# Altium schematic sheet Sensor_Module.SchDoc: Sensor Module
size A4; DocumentNumber: 7; SheetNumber: 7; SheetTotal: 31
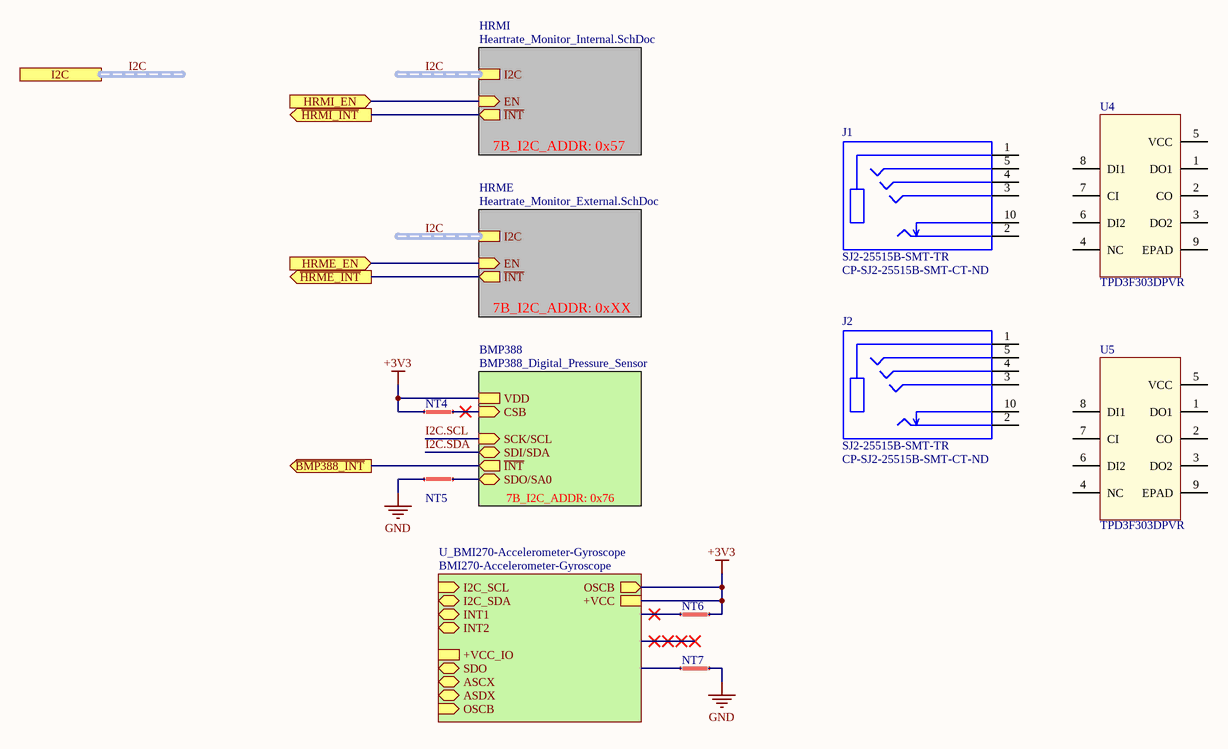
[diagram p0: Sensor_Module.SchDoc]

## Parts
J1  SJ2-25515B-SMT-TR  Supplier Part Number 1: CP-SJ2-25515B-SMT-CT-ND  [CUI_SJ2-25515B-SMT-TR]
J2  SJ2-25515B-SMT-TR  Supplier Part Number 1: CP-SJ2-25515B-SMT-CT-ND  [CUI_SJ2-25515B-SMT-TR]
NT4  Net Tie  [Net Tie 6x30mil]  (value not drawn)  (net tie, no BOM)
NT5  Net Tie  [Net Tie 6x30mil]  (value not drawn)  (net tie, no BOM)
NT6  Net Tie  [Net Tie 6x30mil]  (value not drawn)  (net tie, no BOM)
NT7  Net Tie  [Net Tie 6x30mil]  (value not drawn)  (net tie, no BOM)
U4  TPD3F303DPVR  [DPV8_1P7X0P4]
U5  TPD3F303DPVR  [DPV8_1P7X0P4]

## Sub-sheets
BMP388 = BMP388_Digital_Pressure_Sensor: VDD, SCK/SCL (in), SDI/SDA (bidir), SDO/SA0 (bidir), CSB (in), ~{INT} (out)  | 7B_I2C_ADDR: 0x76
HRME = Heartrate_Monitor_External.SchDoc: I2C (harness I2C), EN (in), ~{INT} (out)  | 7B_I2C_ADDR: 0xXX
HRMI = Heartrate_Monitor_Internal.SchDoc: I2C (harness I2C), EN (in), ~{INT} (out)  | 7B_I2C_ADDR: 0x57
U_BMI270-Accelerometer-Gyroscope = BMI270-Accelerometer-Gyroscope: I2C_SCL (in), I2C_SDA (bidir), INT1 (bidir), INT2 (bidir), +VCC, +VCC_IO, SDO (bidir), ASCX (bidir), ASDX (bidir), OSCB (in), OSCB (out)

## Ports
HRME_EN (in), HRMI_EN (in), I2C (harness I2C), ~{BMP388_INT} (out), ~{HRME_INT} (out), ~{HRMI_INT} (out)

## Nets
+3V3: NT4.1 NT6.2 ; sheet BMP388/VDD, sheet U_BMI270-Accelerometer-Gyroscope/+VCC, sheet U_BMI270-Accelerometer-Gyroscope/OSCB
GND: NT5.2 NT7.2
~{BMP388_INT}: port ~{BMP388_INT}, sheet BMP388/~{INT}
~{HRME_INT}: port ~{HRME_INT}, sheet HRME/~{INT}
~{HRMI_INT}: port ~{HRMI_INT}, sheet HRMI/~{INT}
HRME_EN: port HRME_EN, sheet HRME/EN
HRMI_EN: port HRMI_EN, sheet HRMI/EN
I2C.SCL: sheet BMP388/SCK/SCL
I2C.SDA: sheet BMP388/SDI/SDA
NetNT4_2: NT4.2 ; sheet BMP388/CSB
NetNT5_1: NT5.1 ; sheet BMP388/SDO/SA0

Not connected (* = marked no-connect by the designer): J1 1(OUTER_RING) 2(TIP) 3(RING1) 4(RING2) 5(SLEEVE) 10(TIP_SWITCH); J2 1(OUTER_RING) 2(TIP) 3(RING1) 4(RING2) 5(SLEEVE) 10(TIP_SWITCH); NT6 1*; NT7 1; U4 1(DO1) 2(CO) 3(DO2) 4(NC) 5(VCC) 6(DI2) 7(CI) 8(DI1) 9(EPAD); U5 1(DO1) 2(CO) 3(DO2) 4(NC) 5(VCC) 6(DI2) 7(CI) 8(DI1) 9(EPAD)

## Buses and harness runs
harness I2C = port I2C
harness I2C = sheet HRME/I2C
harness I2C = sheet HRMI/I2C

## Notes on the sheet
- Title
- Size:
- Date:
- A4
- Number:
- Time:
- Revision:
- Sheet
- of
- File:

## Library data of the parts
J1 J2 = SJ2-25515B-SMT-TR: 5 conductor, 2.5 mm, SMT Audio Jack w/ Tip Switch; MF: CUI; Contact: 5(Excludes TIP Switch); Specification: 5-Contact 2.5mm; Package: None; Price: None; Value: *; MP: SJ2-25515B-SMT-TR; Availability: Unavailable; Supplier 1: Digi-Key; Datasheet: https://www.cuidevices.com/product/resource/sj2-2551x-smt.pdf
NT4-NT7 = Net Tie Line: ClassName: Net Tie
U4 U5 = FILTER RC(PI) ESD SMD  8-UFDFN EP: RC (Pi) EMI Filter 2nd Order Low Pass 3 Channel R = 47Ohms, 100Ohms, C = 20pF  8-UFDFN Exposed Pad; Manufacturer: Texas Instruments; Number of Channels: 3; Frequency: 308MHz; ESD Protection: Yes; Operating Supply Voltage: 5.5V; Clamping Voltage: 10V; Supplier 1: Digi-Key; Manufacturer Part Number: TPD3F303DPVR; Stock 1: 4896; Pricing 1: 1=0.85, 10=0.812, 25=0.7856, 50=0.6414, 100=0.576, 250=0.5236, 500=0.4974, 1000=0.4451 (USD); Case/Package: SMD/SMT; Min Operating Temperature: -40°C; Max Operating Temperature: 85°C; Packaging: Tape and Reel; ComponentLink1URL: http://www.ti.com/lit/ds/symlink/tpd3f303.pdf?src-supplier=Digi-Key; ComponentLink1Description: http://www.ti.com/lit/ds/symlink/tpd3f303.pdf?src-supplier=Digi-Key; ComponentLink2URL: http://focus.ti.com/lit/ds/symlink/tpd3f303.pdf?src-supplier=Avnet+Europe; ComponentLink2Description: http://focus.ti.com/lit/ds/symlink/tpd3f303.pdf?src-supplier=Avnet+Europe; ComponentLink3URL: https://www.verical.com/server-webapp/html/getDatasheet?partID=302817&src-supplier=Verical; ComponentLink3Description: https://www.verical.com/server-webapp/html/getDatasheet?partID=302817&src-supplier=Verical; ComponentLink4URL: http://www.farnell.com/datasheets/1558442.pdf?src-supplier=Element14; ComponentLink4Description: http://www.farnell.com/datasheets/1558442.pdf?src-supplier=Element14; Supplier Part Number 1: 296-28299-1-ND; Number of Pins: 8; Contact Plating: Gold; Package Quantity: 1; Capacitance: 20pF; Termination: Flat; Length: 2.2mm; Height: 0.026inch; Width: 0.063inch; Depth: 1.7mm; Radiation Hardening: No; Lead Free: Lead Free; REACH SVHC: No SVHC; Mount: Surface Mount